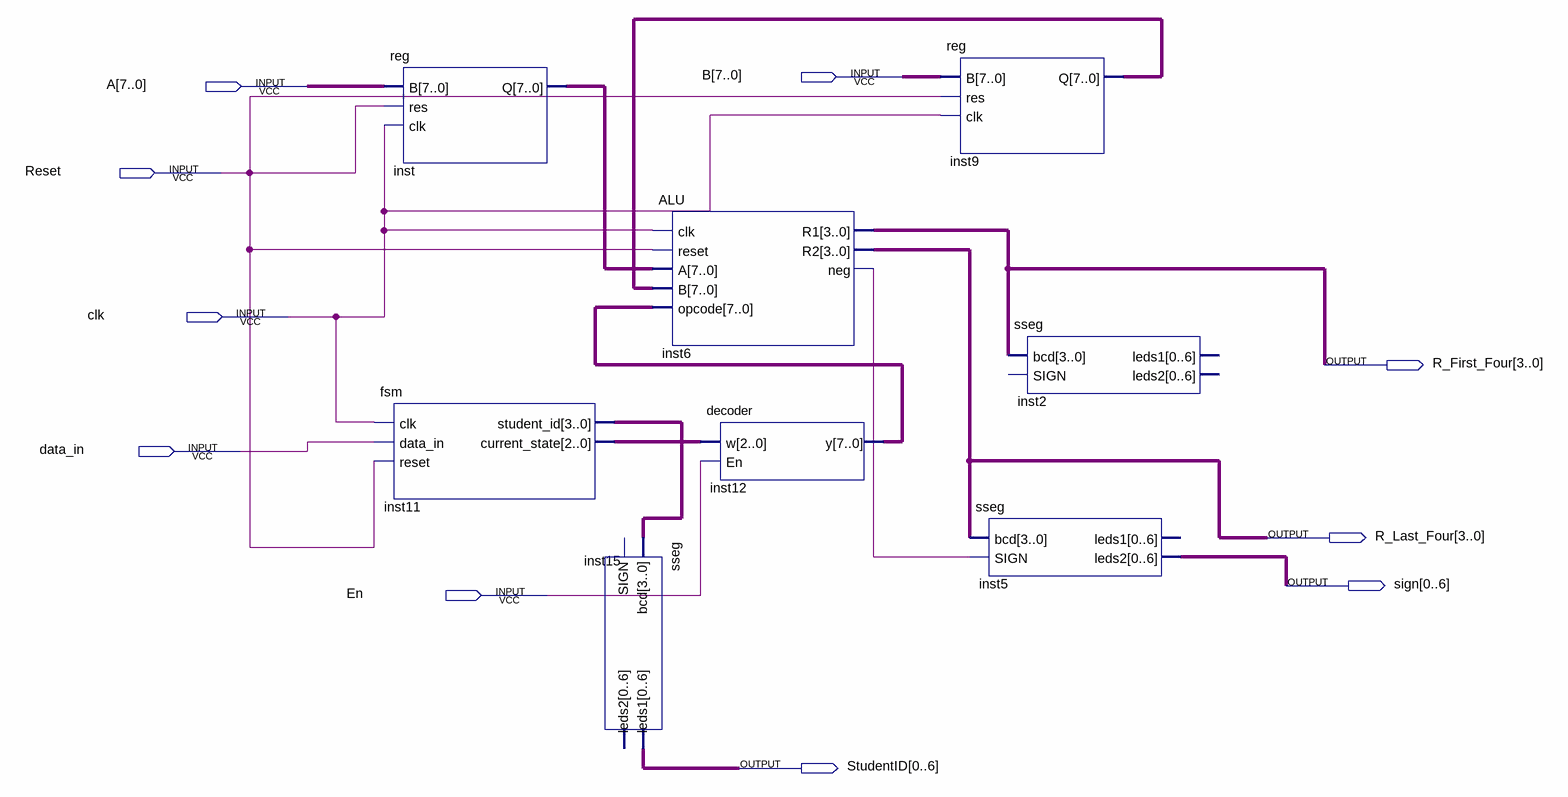
[diagram p0: schematic sheet]
// Quartus schematic Lab6.bdf as structural Verilog: 8 symbols, 10 pins
module Lab6 (
  input  [7:0] B,
  input  [7:0] A,
  input  Reset,
  input  clk,
  input  data_in,
  input  En,
  output [3:0] R_First_Four,
  output [3:0] R_Last_Four,
  output [0:6] sign,
  output [0:6] StudentID
);

  wire inst6_neg;
  wire [2:0] inst11_current_state;
  wire [3:0] inst11_student_id;
  wire [7:0] inst9_q, inst12_y, inst_q;

  fsm inst11 (
    .clk(clk), .data_in(data_in), .reset(Reset), .student_id(inst11_student_id),
    .current_state(inst11_current_state));
  \reg  inst (.B(A), .res(Reset), .clk(clk), .Q(inst_q));
  sseg inst15 (.bcd(inst11_student_id), .leds1(StudentID));  // open: SIGN, leds2
  ALU inst6 (
    .clk(clk), .reset(Reset), .A(inst_q), .B(inst9_q), .opcode(inst12_y), .R1(R_First_Four),
    .R2(R_Last_Four), .neg(inst6_neg));
  decoder inst12 (.w(inst11_current_state), .En(En), .y(inst12_y));
  \reg  inst9 (.B(B), .res(Reset), .clk(clk), .Q(inst9_q));
  sseg inst5 (.bcd(R_Last_Four), .SIGN(inst6_neg), .leds2(sign));  // open: leds1
  sseg inst2 (.bcd(R_First_Four));  // open: SIGN, leds1, leds2
endmodule
